# Altium schematic sheet power_supply.SchDoc
size 447 x 332 mm
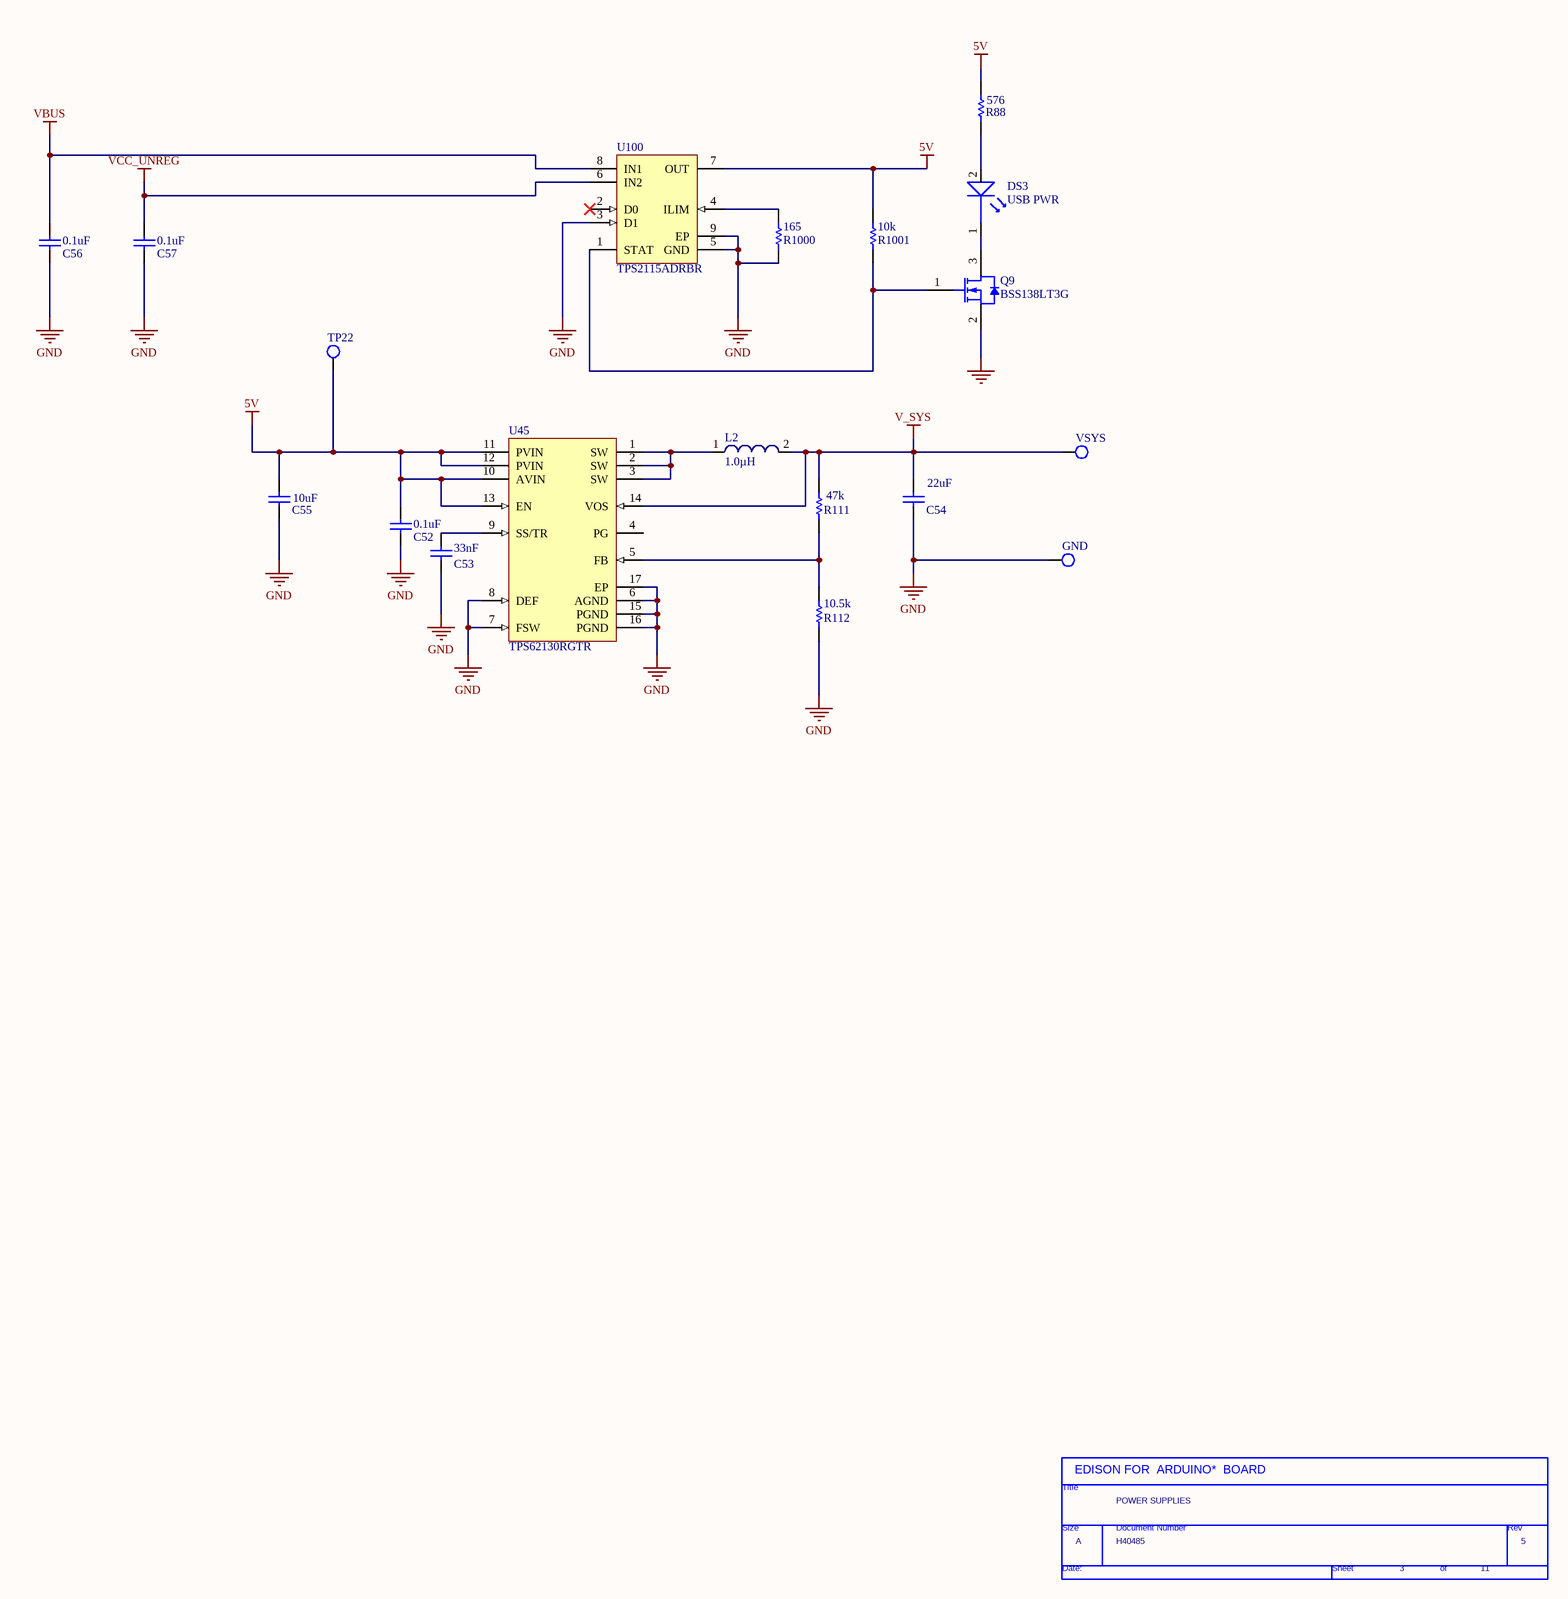
[diagram p0: power_supply.SchDoc]

## Parts
*  Page Count: 11  Page Number: 3  Page Size: A  Title: POWER SUPPLIES  RevCode: 5  Doc: H40485  (hidden comment: TitleBlock0)  (graphical)
C52  value 0.1uF  [CAPC0805(2012)145_L]  (hidden comment: CAP 100nF 16V 0805(2012))
C53  value 33nF  [CAPC0805(2012)145_L]  (hidden comment: CAP 33nF 50V 0805(2012))
C54  value 22uF  [CAPC0805(2012)145_M]  (hidden comment: CAP 22uF 6.3V 0805(2012))
C55  value 10uF  [CAPC0805(2012)145_L]  (hidden comment: CAP 820pF 25V 0805(2012))
C56  value 0.1uF  [CAPC0805(2012)145_L]  (hidden comment: CAP 100nF 16V 0805(2012))
C57  value 0.1uF  [CAPC0805(2012)145_L]  (hidden comment: CAP 100nF 16V 0805(2012))
DS3  USB PWR  [LTST-C281KGKT]
GND  Testpoint  [Tespoint_Keystone]  (value not drawn)  (no BOM)
L2  1.0µH  [SMD 2508]
Q9  BSS138LT3G  [ONSC-SOT-23-3-318-08_V]
R88  value 576  [RESC0603(1608)_N]  (hidden comment: 576R 1% 0603(1608))
R111  value 47k  [RESC0603(1608)_N]  (hidden comment: 47K 1% 0603(1608))
R112  value 10.5k  [RESC0603(1608)_N]  (hidden comment: 10K5 1% 0603(1608))
R1000  value 165  [RESC0805(2012)_L]  (hidden comment: 165R 1% 0805(2012))
R1001  value 10k  [RESC0805(2012)_M]  (hidden comment: 10K 1% 0805(2012))
TP22  Testpoint  [Tespoint_Keystone]  (value not drawn)  (no BOM)
U45  TPS62130RGTR  [RGT16-1700X1700TP]
U100  TPS2115ADRBR  [DRB8-2400X1650TP]
VSYS  Testpoint  [Tespoint_Keystone]  (value not drawn)  (no BOM)

## Nets
5V: C52.1 C55.2 R88.2 R1001.2 TP22.1(TP) U45.10(AVIN) U45.11(PVIN) U45.12(PVIN) U45.13(EN) U100.7(OUT)
GND: C52.2 C53.1 C54.1 C55.1 C56.2 C57.2 GND.1(TP) Q9.2(S) R112.1 R1000.1 U45.6(AGND) U45.7(FSW) U45.8(DEF) U45.15(PGND) U45.16(PGND) U45.17(EP) U100.3(D1) U100.5(GND) U100.9(EP)
V_SYS: C54.2 L2.2 R111.2 U45.14(VOS) VSYS.1(TP)
VBUS: C56.1 U100.8(IN1)
VCC_UNREG: C57.1 U100.6(IN2)
NetC53_2: C53.2 U45.9(SS/TR)
NetDS3_1: DS3.1(LED1) Q9.3(D)
NetDS3_2: DS3.2(LED2) R88.1
NetL2_1: L2.1 U45.1(SW) U45.2(SW) U45.3(SW)
NetQ9_1: Q9.1(G) R1001.1 U100.1(STAT)
NetR111_1: R111.1 R112.2 U45.5(FB)
NetR1000_2: R1000.2 U100.4(ILIM)

Not connected (* = marked no-connect by the designer): U45 4(PG); U100 2(D0)*

## Notes on the sheet
- (in symbol TitleBlock0) EDISON FOR  ARDUINO*  BOARD; Title; Size; Document Number; Rev; Date:; Sheet; of

## Library data of the parts
C52 C56 C57 = CMP-1036-04401-1: CAP 100nF 16V ±10% 0805 (2012 Metric) Thickness 1.45mm SMD; Case-Metric: 2012; Case-EIA: 0805; Max Thickness: 1.45 mm; Technology: SMT; Tolerance: ±10%; Rated Voltage: 16 V; Supplier 1: Digi-Key; Supplier Part Number 1: 311-1142-1-ND
C53 = CMP-1036-04168-1: CAP 33nF 50V ±10% 0805 (2012 Metric) Thickness 1.45mm SMD; Case-Metric: 2012; Case-EIA: 0805; Max Thickness: 1.45 mm; Rated Voltage: 50 V; Tolerance: ±10%; Technology: SMT; Supplier 1: Digi-Key; Supplier Part Number 1: 311-1131-1-ND
C54 = CMP-1036-04939-1: CAP 22uF 6.3V ±20% 0805 (2012 Metric) Thickness 1.45mm SMD; Case-EIA: 0805; Case-Metric: 2012; Max Thickness: 1.45 mm; Technology: SMT; Rated Voltage: 6.3 V; Tolerance: ±20%; Supplier 1: Digi-Key; Supplier Part Number 1: 311-1464-1-ND
C55 = CMP-1036-02893-1: CAP 820pF 25V ±10% 0805 (2012 Metric) Thickness 1.45mm SMD; Case-Metric: 2012; Case-EIA: 0805; Tolerance: ±10%; Technology: SMT; Max Thickness: 1.35 mm; Rated Voltage: 25 V; Supplier 1: Digi-Key; Supplier Part Number 1: 490-5523-6-ND
DS3 = LED_Edison: Supplier 1: Digi-Key; Supplier Part Number 1: VLMG1500-GS08CT-ND
L2 = WE-MAPI 2508 ,74438322010: Power Multilayer Inductor WE-MAPI, L=1.0µH; Manufacturer: Würth Elektronik eiSos GmbH; partNo: 74438322010; Inductance: 1.0µH; ComponentLink1Description: Manufacturer; ComponentLink1URL: http://www.we-online.de; Created by: Otto Christin; Created Date: Nov 2013; ComponentLink2Description: Datasheet; ComponentLink2URL: http://katalog.we-online.de/kataloge/eisos/media/pdf/74438322010.pdf; Supplier 1: Digi-Key; Supplier Part Number 1: 732-4768-6-ND
Q9 = CMP-1058-00765-1: Power MOSFET, 200 mA, 50 V, N-Channel, 3-Pin SOT-23, Pb-Free, Tape and Reel; Manufacturer: On Semiconductor; PD Max (W): 0.225; Channel Polarity: N Channel; Crss Typ (pF): 3.5; Configuration: Single; ID Max (A): 0.2; Ciss Typ (pF): 40; V(BR)DSS Min (V): 50; VGS(th) Max (V): 1.5; Coss Typ (pF): 12; VGS Max (V): 20; ComponentLink2URL: http://www.onsemi.com/pub_link/Collateral/BSS138LT1-D.PDF; PackageDescription: 3-Pin Small Outline Transistor, Body 2.92 x 1.3 mm, Pitch 0.95 mm; Package Type: SOT-23-3; Mounting Technology: Surface Mount; ComponentLink1Description: Manufacturer URL; PackageVersion: Rev. AP, 11/2009; ComponentLink3Description: Package Specification; DatasheetVersion: Rev. 8; RoHS: Pb-Free; Packing: Tape and Reel; PackageReference: SOT-23-3-318-08; PartNumber: BSS138LT3G; ComponentLink3URL: http://www.onsemi.cn/pub_link/Collateral/318-08.PDF; ComponentLink1URL: http://www.onsemi.com/; ComponentLink2Description: Datasheet; Supplier 1: Digi-Key; Supplier Part Number 1: BSS138LT1GOSCT-ND
R88 = CMP-1012-00483-1: 576R 0.1W 1% 0603 (1608 Metric)  SMD; Case-Metric: 1608; Case-EIA: 0603; Tolerance: 1 %; Power: 0.1 W; Technology: SMT; Supplier 1: Digi-Key; Supplier Part Number 1: 311-576HRCT-ND
R111 = CMP-1012-00699-1: 47K 0.1W 1% 0603 (1608 Metric)  SMD; Case-Metric: 1608; Case-EIA: 0603; Technology: SMT; Power: 0.1 W; Tolerance: 1 %; Supplier 1: Digi-Key; Supplier Part Number 1: 311-47.0KHRCT-ND
R112 = CMP-1012-00625-1: 10K5 0.1W 1% 0603 (1608 Metric)  SMD; Case-EIA: 0603; Case-Metric: 1608; Power: 0.1 W; Technology: SMT; Tolerance: 1 %; Supplier 1: Digi-Key; Supplier Part Number 1: 311-10.5KHRCT-ND
R1000 = CMP-1013-00420-1: 165R 0.125W 1% 0805 (2012 Metric)  SMD; Case-Metric: 2012; Case-EIA: 0805; Tolerance: 1 %; Technology: SMT; Power: 0.125 W; Supplier 1: Digi-Key; Supplier Part Number 1: 311-165CRCT-ND
R1001 = CMP-1013-00623-1: 10K 0.125W 1% 0805 (2012 Metric)  SMD; Case-Metric: 2012; Case-EIA: 0805; Tolerance: 1 %; Power: 0.125 W; Technology: SMT; Supplier 1: Digi-Key; Supplier Part Number 1: 311-10.0KCRCT-ND
U45 = CMP-0323-00115-2: Buck Step Down Regulator with 3 to 17 V Input and 0.9 to 6 V Output, -40 to 85 degC, 16-Pin QFN (RGT), Green (RoHS & no Sb/Br); Manufacturer: Texas Instruments; Vout(Min)(V): 0.9; SubFamily: Step-Down Regulator; Regulated Outputs(#): 1; Switch Current Limit(Typ)(A): 4.2; Vout(Max)(V): 6; Synchronous Rectification: TRUE; Vin(Min)(V): 3; Vin(Max)(V): 17; Iq(Typ)(mA): 0.017; Rating: Catalog; Duty Cycle(Max)(%): 100; ComponentLink1URL: http://www.ti.com/general/docs/lit/getliterature.tsp?genericPartNumber=TPS62130&fileType=pdf; ComponentLink1Description: Datasheet; ComponentLink2URL: http://www.ti.com/litv/pdf/mpqf119g; PartNumber: TPS62130RGTR; ComponentLink3Description: URL Link1; ComponentLink2Description: Package Specification; DatasheetVersion: SLVSAG7; Mounting Technology: Surface Mount; Code_JEDEC: MO-220; PackageReference: RGT16-1700X1700TP; Topology: Buck; ComponentLink3URL: Samples URL:http://www.ti.com/product/tps62130#samples; Eco-Plan: Green (RoHS & no Sb/Br); PackageVersion: revH, Oct-2011; Iout(Max)(A): 3; PackageDescription: 16-Pin Plastic Quad Flat No-Lead, 3 x 3 mm Body, 0.5 mm Pitch, 1.7 x 1.7 mm Exposed Pad; Supplier 1: Digi-Key; Supplier Part Number 1: 296-37682-6-ND
U100 = TPS2115ADRBR: Dual In / Single Out Autoswitching Power Mux, 2.8 to 5.5 V, -40 to 85 degC, 8-pin SON (DRB), Green (RoHS & no Sb/Br); Manufacturer: Texas Instruments; IN1 Output Current(Max)(A): 1.25; IN1 rDS(on)(Typ)(mOhm): 84; IN1, IN2 Input Voltage(Max)(V): 5.5; IN1, IN2 Input Voltage(Min)(V): 2.8; IN2 rDS(on)(Typ)(Ohms): 0.084; Number of Inputs: 2; SubFamily: Power Multiplexer (MUX); DatasheetVersion: SBVS044F; PackageVersion: revK, Jun-2012; PackageReference: DRB8-2400X1650TP; PackageDescription: 8-Pin Plastic Small Outline No-Lead, 3 x 3 x 1 mm Body, 0.65 mm Pitch, Exposed Pad; Supplier 1: Digi-Key; Supplier Part Number 1: 296-23394-1-ND; Supplier 2: Newark; Supplier Part Number 2: 99M6394; Eco-Plan: Green (RoHS & no Sb/Br); IN2 Output Current(Max)(A): 1.25; Mounting Technology: Surface Mount; PartNumber: TPS2115ADRBR; ComponentLink1Description: Datasheet; ComponentLink1URL: http://www.ti.com/general/docs/lit/getliterature.tsp?genericPartNumber=TPS2115A&fileType=pdf
* = TitleBlock0: Page Create Date: March  8, 1995
GND TP22 VSYS = TestPoint: Supplier 1: Digi-Key; Supplier Part Number 1: 5000K-ND